# Altium schematic sheet Sheet5.SchDoc
size A4; SheetNumber: 5; SheetTotal: 5
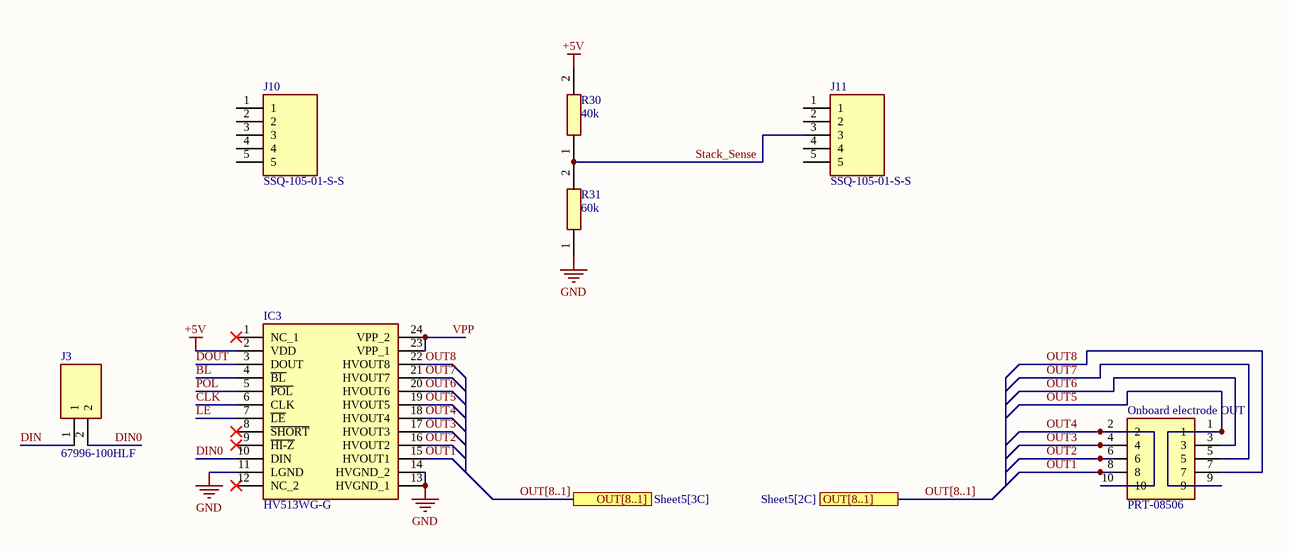
[diagram p0: Sheet5.SchDoc]

## Parts
IC3  HV513WG-G  [SOIC127P1030X265-24N]
J3  67996-100HLF  [HDRV2W67P254_2X1_254X483X858P]
J10  SSQ-105-01-S-S  [RHDR5W64P254_1X5_1321X241X851P]
J11  SSQ-105-01-S-S  [RHDR5W64P254_1X5_1321X241X851P]
Onboard_electrode_OUT  PRT-08506  [SHDR10W64P254_2X5_2025X900X935P]
R30  40k  [ERJP06D1000V]
R31  60k  [ERJP06D1000V]

## Ports
OUT[8..1] (see Sheet5[2C]), OUT[8..1] (see Sheet5[3C])

## Nets
+5V: IC3.2(VDD) R30.2
GND: IC3.11(LGND) IC3.13(HVGND_1) IC3.14(HVGND_2) R31.1
BL: IC3.4(~{BL})
CLK: IC3.6(CLK)
DIN: J3.1
DIN0: IC3.10(DIN) J3.2
DOUT: IC3.3(DOUT)
LE: IC3.7(~{LE})
OUT1: IC3.15(HVOUT1) Onboard_electrode_OUT.8
OUT2: IC3.16(HVOUT2) Onboard_electrode_OUT.6
OUT3: IC3.17(HVOUT3) Onboard_electrode_OUT.4
OUT4: IC3.18(HVOUT4) Onboard_electrode_OUT.2 Onboard_electrode_OUT.10
OUT5: IC3.19(HVOUT5) Onboard_electrode_OUT.1 Onboard_electrode_OUT.9
OUT6: IC3.20(HVOUT6) Onboard_electrode_OUT.3
OUT7: IC3.21(HVOUT7) Onboard_electrode_OUT.5
OUT8: IC3.22(HVOUT8) Onboard_electrode_OUT.7
POL: IC3.5(~{POL})
Stack_Sense: J11.3 R30.1 R31.2
VPP: IC3.23(VPP_1) IC3.24(VPP_2)

Not connected (* = marked no-connect by the designer): IC3 1(NC_1)* 8(~{SHORT})* 9(~{HI-Z})* 12(NC_2)*; J10 1 2 3 4 5; J11 1 2 4 5

## Buses and harness runs
bus OUT[8..1] = port OUT[8..1]

## Library data of the parts
IC3 = HV513WG-G: Integrated Circuit; Manufacturer_Name: Microchip; Datasheet Link: http://ww1.microchip.com/downloads/en/DeviceDoc/20005846A.pdf; Height: 2.65mm; Manufacturer_Part_Number: HV513WG-G; Mouser Part Number: 689-HV513WG-G; Mouser Price/Stock: https://www.mouser.co.uk/ProductDetail/Microchip-Technology/HV513WG-G?qs=wSTxOR59s%2FzutPVpK8md7g%3D%3D; Arrow Part Number: HV513WG-G; Arrow Price/Stock: https://www.arrow.com/en/products/hv513wg-g/microchip-technology?region=nac
J3 = 67996-100HLF: BergStik<sup>&reg;</sup>, Board to Board connector, Unshrouded vertical header, Through Hole, Double Row, 0 Positions, 2.54 mm (0.100in) Pitch; Manufacturer_Name: Amphenol Communications Solutions; Geometry.Height: 8.58mm; Mouser Part Number: *; Mouser Price/Stock: *; Manufacturer_Part_Number: 67996-100HLF; Datasheet Link: https://cdn.amphenol-cs.com/media/wysiwyg/files/drawing/67996.pdf
J10 J11 = SSQ-105-01-S-S: 5 Position, .100&quot; Tiger Buy&trade; Socket Strip, Square Tail, Single Row; Manufacturer_Name: SAMTEC; Geometry.Height: 8.51mm; Mouser Part Number: 200-SSQ10501SS; Mouser Price/Stock: https://www.mouser.co.uk/ProductDetail/Samtec/SSQ-105-01-S-S?qs=rU5fayqh%252BE15SmaD0WxGBw%3D%3D; Manufacturer_Part_Number: SSQ-105-01-S-S; Datasheet Link: http://suddendocs.samtec.com/prints/ssq-1xx-xx-xxx-x-xx-xxx-xx-x-mkt.pdf
Onboard_electrode_OUT = PRT-08506: Connector; Manufacturer_Name: SparkFun; Datasheet Link: https://www.sparkfun.com/datasheets/Prototyping/Shrouded-10pin.pdf; Height: 9.35mm; Manufacturer_Part_Number: PRT-08506; Mouser Part Number: 474-PRT-08506; Mouser Price/Stock: https://www.mouser.co.uk/ProductDetail/SparkFun/PRT-08506?qs=WyAARYrbSnY9pAhwbp%252BzlQ%3D%3D
R30 R31 = ERJ-P06F5103V: Resistor; Manufacturer_Name: Panasonic; Datasheet Link: http://industrial.panasonic.com/cdbs/www-data/pdf/RDA0000/AOA0000C102.pdf; Height: 0.7mm; Manufacturer_Part_Number: ERJ-P06F5103V; Mouser Part Number: 667-ERJ-P06F5103V; Mouser Price/Stock: https://www.mouser.co.uk/ProductDetail/Panasonic/ERJ-P06F5103V?qs=iIVTEDlrHA2ZP3yozH4uHg%3D%3D